# EAGLE design oresat-plusz-end-card (EAGLE 9.3.0)

## Sheet 1 of 3: Connectors
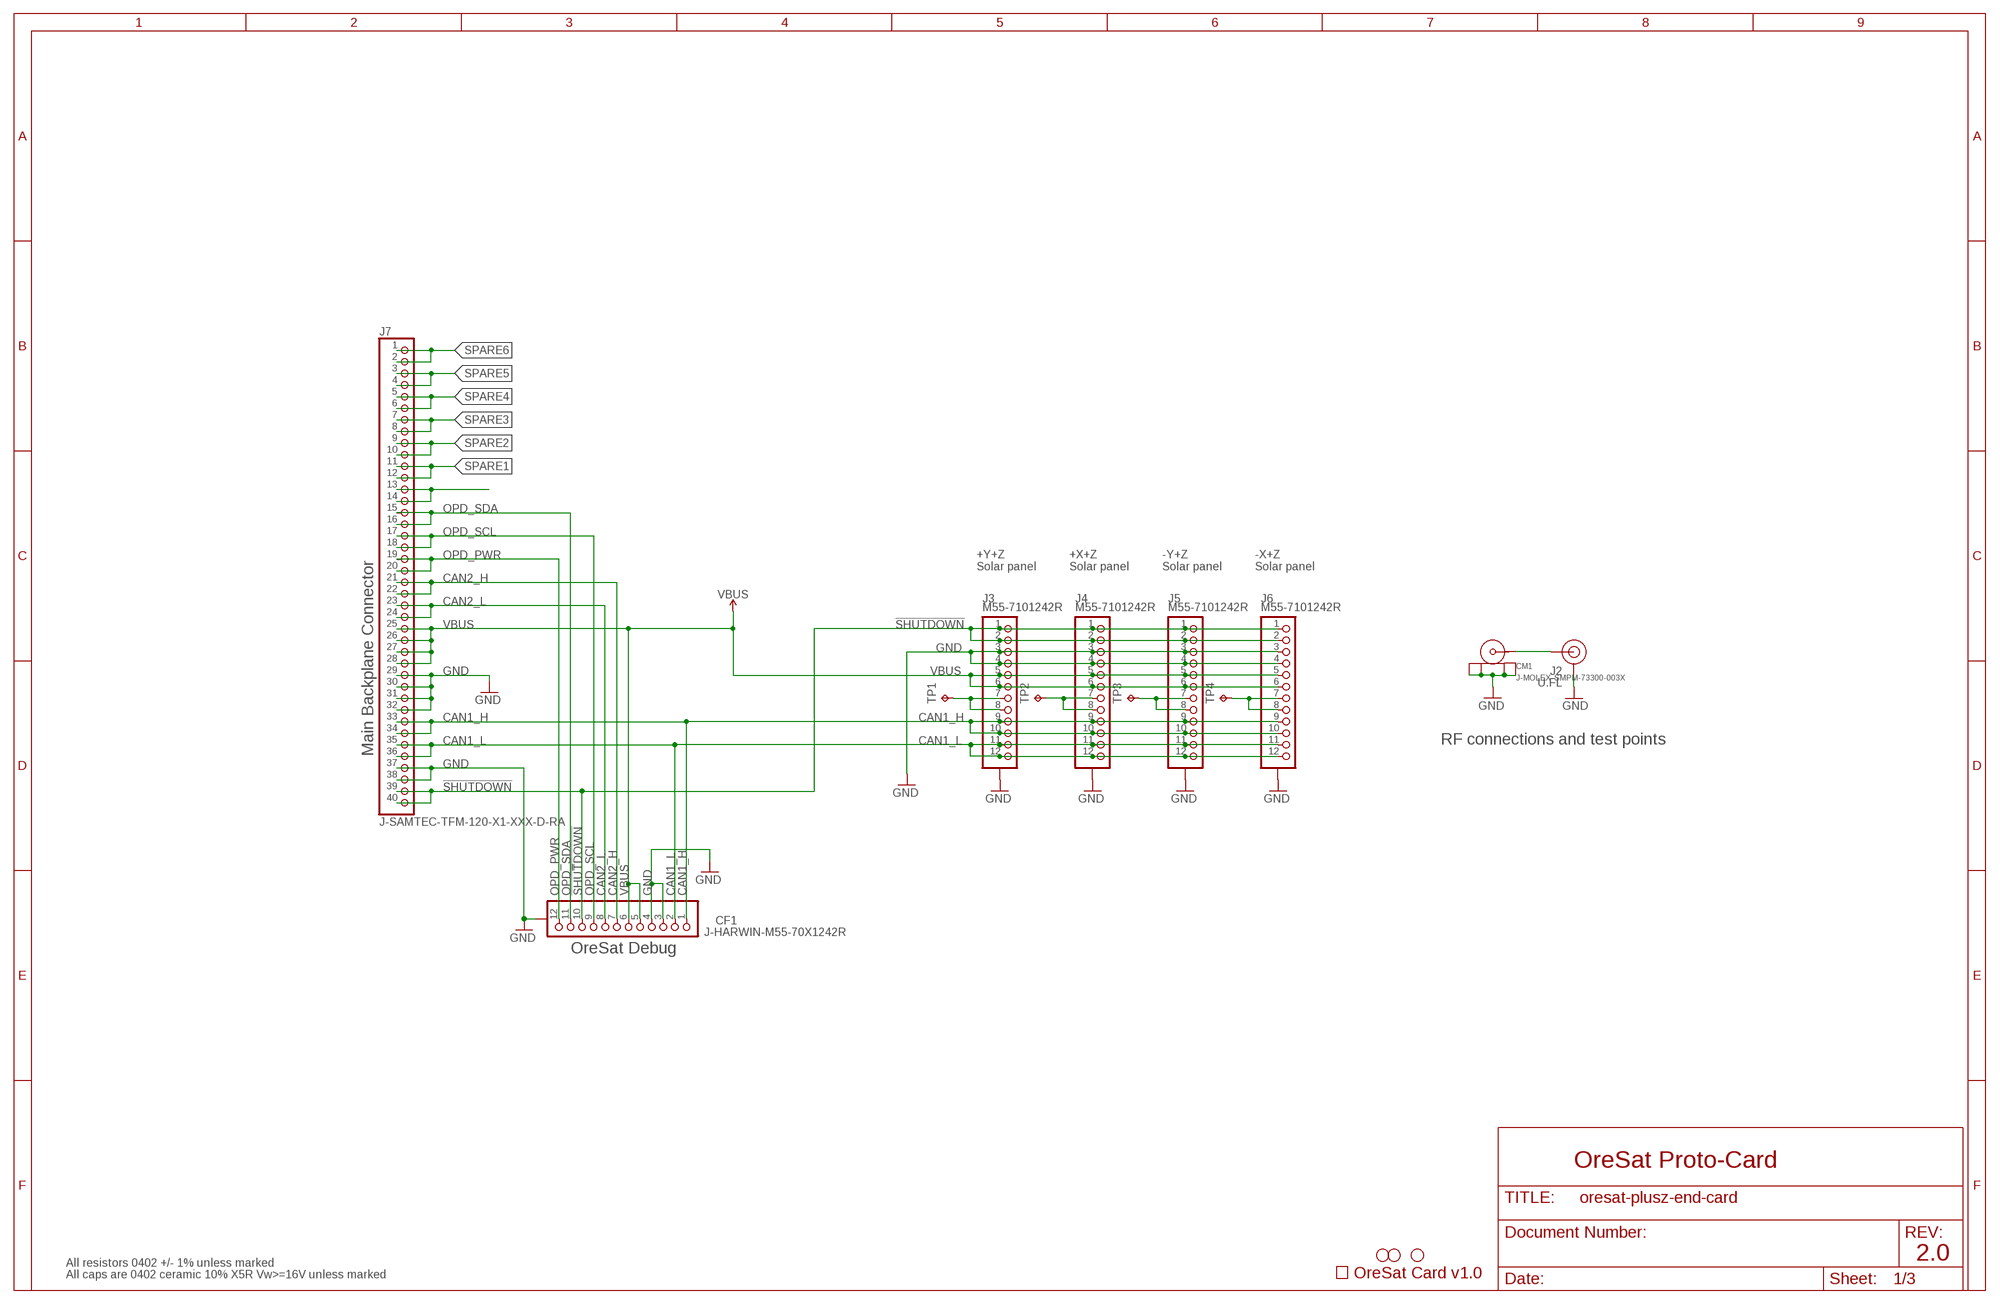
[diagram p0: schematic, sheet 1]

### Parts
CARD  ORESAT-CARD-V0.5  [ORESAT-CARD-V1.0]
CF1  J-HARWIN-M55-70X1242R  [HARWIN-M55-70X1242R]
CM1  J-MOLEX-SMPM-73300-003X  [J-MOLEX-SMPM-073300-003X]
H1  STAND-OFFTIGHT  [STAND-OFF-TIGHT]
H2  STAND-OFFTIGHT  [STAND-OFF-TIGHT]
H4  STAND-OFFTIGHT  [STAND-OFF-TIGHT]
J2  U.FL  U.FL2PIN  [U.FL]
J3  M55-7101242R  [M55-7101242R]
J4  M55-7101242R  [M55-7101242R]
J5  M55-7101242R  [M55-7101242R]
J6  M55-7101242R  [M55-7101242R]
J7  J-SAMTEC-TFM-120-X1-XXX-D-RA  [J-SAMTEC-TFM-120-X1-XXX-D-RA]
TP1  TPPAD1-13  [P1-13]
TP2  TPPAD1-13  [P1-13]
TP3  TPPAD1-13  [P1-13]
TP4  TPPAD1-13  [P1-13]

### Nets
!SHUTDOWN: CF1.10 J3.1 J3.2 J4.1 J4.2 J5.1 J5.2 J6.1 J6.2 J7.39 J7.40
CAN1_H: CF1.1 J3.9 J3.10 J4.9 J4.10 J5.9 J5.10 J6.9 J6.10 J7.33 J7.34 ; also sheet 3
CAN1_L: CF1.2 J3.11 J3.12 J4.11 J4.12 J5.11 J5.12 J6.11 J6.12 J7.35 J7.36 ; also sheet 3
CAN2_H: CF1.7 J7.21 J7.22
CAN2_L: CF1.8 J7.23 J7.24
GND: CF1.3 CF1.4 CF1.P$1(SHIELDS) CF1.P$2(SHIELDS) CF1.P$3(SHIELDS) CF1.P$4(SHIELDS) CM1.P$1(SHIELD3) CM1.P$2(SHIELD2) CM1.P$3(SHIELD1) CM1.P$4(SHIELD) J2.1(GND) J2.2(GND) J3.3 J3.4 J3.P$1(SHIELD) J3.P$2(SHIELD) J3.P$3(SHIELD) J3.P$4(SHIELD) J4.3 J4.4 J4.P$1(SHIELD) J4.P$2(SHIELD) J4.P$3(SHIELD) J4.P$4(SHIELD) J5.3 J5.4 J5.P$1(SHIELD) J5.P$2(SHIELD) J5.P$3(SHIELD) J5.P$4(SHIELD) J6.3 J6.4 J6.P$1(SHIELD) J6.P$2(SHIELD) J6.P$3(SHIELD) J6.P$4(SHIELD) J7.29 J7.30 J7.31 J7.32 J7.37 J7.38 ; also sheet 2,3
N$1: J4.7 J4.8 TP2.TP
N$2: J3.7 J3.8 TP1.TP
N$4: J5.7 J5.8 TP3.TP
N$5: J6.7 J6.8 TP4.TP
N$15: J7.13 J7.14
OPD_PWR: CF1.12 J7.19 J7.20 ; also sheet 2
OPD_SCL: CF1.9 J7.17 J7.18 ; also sheet 2
OPD_SDA: CF1.11 J7.15 J7.16 ; also sheet 2
RF1: CM1.RF(CENTER) J2.FEED(SIGNAL)
SPARE1: J7.11 J7.12
SPARE2: J7.9 J7.10
SPARE3: J7.7 J7.8
SPARE4: J7.5 J7.6
SPARE5: J7.3 J7.4
SPARE6: J7.1 J7.2
VBUS: CF1.5 CF1.6 J3.5 J3.6 J4.5 J4.6 J5.5 J5.6 J6.5 J6.6 J7.25 J7.26 J7.27 J7.28 ; also sheet 2

### Notes on the sheet
- +Y+Z
  Solar panel
- +X+Z
  Solar panel
- -Y+Z
  Solar panel
- -X+Z
  Solar panel
- RF connections and test points
- Main Backplane Connector
- OreSat Debug
- OreSat Proto-Card
- 2.0
- All resistors 0402 +/- 1% unless marked
- All caps are 0402 ceramic 10% X5R Vw>=16V unless marked

## Sheet 2 of 3: Power
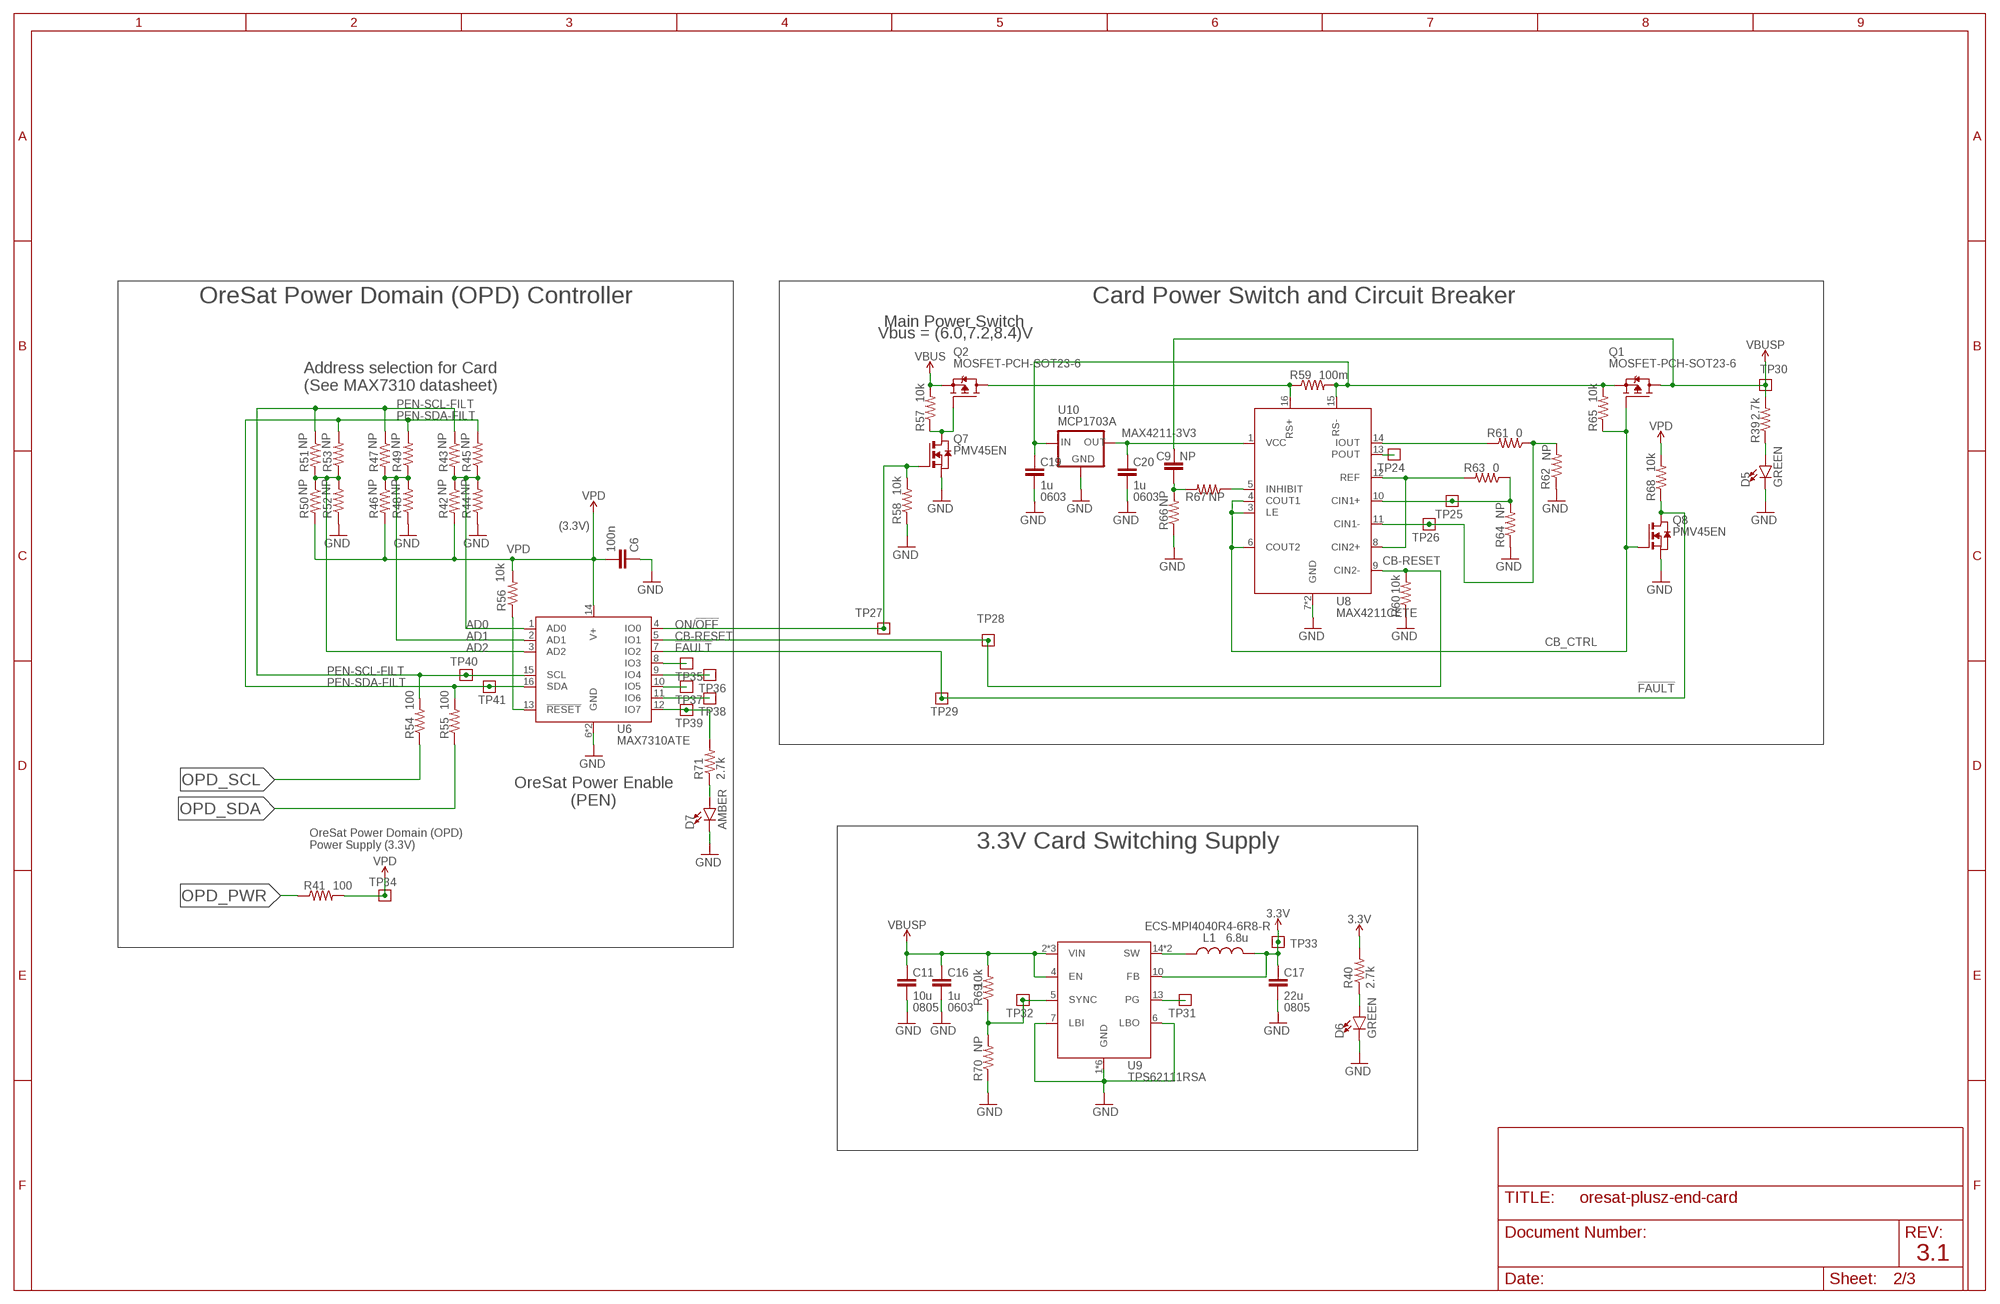
[diagram p1: schematic, sheet 2]

### Parts
C6  100n  C-EU0402-B-NOSILK  [.0402-B-NOSILK]
C9  NP  C-EU0402-B-NOSILK  [.0402-B-NOSILK]
C11  10u  C-EU0805-B-NOSILK  [.0805-B-NOSILK]
C16  1u  C-EU0603-B-NOSILK  [.0603-B-NOSILK]
C17  22u  C-EU0805-B-NOSILK  [.0805-B-NOSILK]
C19  1u  C-EU0603-B-NOSILK  [.0603-B-NOSILK]
C20  1u  C-EU0603-B-NOSILK  [.0603-B-NOSILK]
D5  GREEN  LED-GREEN0603  [LED-0603]
D6  GREEN  LED-GREEN0603  [LED-0603]
D7  AMBER  LED-GREEN0603  [LED-0603]
L1  6.8u  L-ECS-MPI4040  [ECS-MPI4040]
Q1  MOSFET-PCH-SOT23-6  [SOT23-6]
Q2  MOSFET-PCH-SOT23-6  [SOT23-6]
Q7  PMV45EN  [SOT23]
Q8  PMV45EN  [SOT23]
R39  2.7k  R-US_0402-B-NOSILK  [.0402-B-NOSILK]
R40  2.7k  R-US_0402-B-NOSILK  [.0402-B-NOSILK]
R41  100  R-US_0402-B-NOSILK  [.0402-B-NOSILK]
R42  NP  R-US_0402-B-NOSILK  [.0402-B-NOSILK]
R43  NP  R-US_0402-B-NOSILK  [.0402-B-NOSILK]
R44  NP  R-US_0402-B-NOSILK  [.0402-B-NOSILK]
R45  NP  R-US_0402-B-NOSILK  [.0402-B-NOSILK]
R46  NP  R-US_0402-B-NOSILK  [.0402-B-NOSILK]
R47  NP  R-US_0402-B-NOSILK  [.0402-B-NOSILK]
R48  NP  R-US_0402-B-NOSILK  [.0402-B-NOSILK]
R49  NP  R-US_0402-B-NOSILK  [.0402-B-NOSILK]
R50  NP  R-US_0402-B-NOSILK  [.0402-B-NOSILK]
R51  NP  R-US_0402-B-NOSILK  [.0402-B-NOSILK]
R52  NP  R-US_0402-B-NOSILK  [.0402-B-NOSILK]
R53  NP  R-US_0402-B-NOSILK  [.0402-B-NOSILK]
R54  100  R-US_0402-B-NOSILK  [.0402-B-NOSILK]
R55  100  R-US_0402-B-NOSILK  [.0402-B-NOSILK]
R56  10k  R-US_0402-B-NOSILK  [.0402-B-NOSILK]
R57  10k  R-US_0402-B-NOSILK  [.0402-B-NOSILK]
R58  10k  R-US_0402-B-NOSILK  [.0402-B-NOSILK]
R59  100m  R-US_R1206  [R1206]
R60  10k  R-US_0402-B-NOSILK  [.0402-B-NOSILK]
R61  0  R-US_0402-B-NOSILK  [.0402-B-NOSILK]
R62  NP  R-US_0402-B-NOSILK  [.0402-B-NOSILK]
R63  0  R-US_0402-B-NOSILK  [.0402-B-NOSILK]
R64  NP  R-US_0402-B-NOSILK  [.0402-B-NOSILK]
R65  10k  R-US_0402-B-NOSILK  [.0402-B-NOSILK]
R66  NP  R-US_0402-B-NOSILK  [.0402-B-NOSILK]
R67  NP  R-US_0402-B-NOSILK  [.0402-B-NOSILK]
R68  10k  R-US_0402-B-NOSILK  [.0402-B-NOSILK]
R69  10k  R-US_0402-B-NOSILK  [.0402-B-NOSILK]
R70  NP  R-US_0402-B-NOSILK  [.0402-B-NOSILK]
R71  2.7k  R-US_0402-B-NOSILK  [.0402-B-NOSILK]
TP24  TEST-POINT  [2MM-TEST-POINT]
TP25  TEST-POINT  [2MM-TEST-POINT]
TP26  TEST-POINT  [2MM-TEST-POINT]
TP27  TEST-POINT  [2MM-TEST-POINT]
TP28  TEST-POINT  [2MM-TEST-POINT]
TP29  TEST-POINT  [2MM-TEST-POINT]
TP30  TEST-POINT  [2MM-TEST-POINT]
TP31  TEST-POINT  [2MM-TEST-POINT]
TP32  TEST-POINT  [2MM-TEST-POINT]
TP33  TEST-POINT  [2MM-TEST-POINT]
TP34  TEST-POINT  [2MM-TEST-POINT]
TP35  TEST-POINT  [2MM-TEST-POINT]
TP36  TEST-POINT  [2MM-TEST-POINT]
TP37  TEST-POINT  [2MM-TEST-POINT]
TP38  TEST-POINT  [2MM-TEST-POINT]
TP39  TEST-POINT  [2MM-TEST-POINT]
TP40  TEST-POINT  [2MM-TEST-POINT]
TP41  TEST-POINT  [2MM-TEST-POINT]
U6  MAX7310ATE  MAX7310  [QFN65P400X400X80-17T210]
U8  MAX4211CETE  MAX4211  [QFN65P400X400X80-17T210]
U9  TPS62111RSA  TPS6211X  [S-PVQFN-16]
U10  MCP1703A  XC63FPM  [SOT23]

### Nets
3.3V: C17.1 L1.2 R40.2 TP33.1 U9.10(FB) ; also sheet 3
!FAULT: Q8.3(D) R68.1 TP29.1 U6.7(IO2)
AD0: R42.1 R43.2 R44.2 R45.1 U6.1(AD0)
AD1: R46.1 R47.2 R48.2 R49.1 U6.2(AD1)
AD2: R50.1 R51.2 R52.2 R53.1 U6.3(AD2)
CB-RESET: R60.2 TP28.1 U6.5(IO1) U8.9(CIN2-)
CB_CTRL: Q1.3(G) Q8.1(G) R65.1 U8.3(LE) U8.4(COUT1) U8.6(COUT2)
GND: C6.1 C11.2 C16.2 C17.2 C19.2 C20.2 D5.C D6.C D7.C Q7.2(S) Q8.2(S) R44.1 R48.1 R52.1 R58.1 R60.1 R62.1 R64.1 R66.1 R70.1 U6.6(GND) U6.EPAD(GND) U8.7(GND) U8.EPAD(GND) U9.1(GND) U9.6(LBO) U9.7(LBI) U9.9(GND) U9.11(GND) U9.12(GND) U9.16(GND) U9.PAD(GND) U10.1(GND) ; also sheet 1,3
MAX4211-3V3: C20.1 U8.1(VCC) U10.2(OUT)
N$6: D5.A R39.1
N$8: D6.A R40.1
N$9: R56.1 U6.13(!RESET)
N$10: Q2.3(G) Q7.3(D) R57.1
N$11: Q2.1(D) Q2.2(D) Q2.5(D) Q2.6(D) R59.1 U8.16(RS+)
N$12: R61.1 R62.2 TP26.1 U8.11(CIN1-)
N$13: R63.1 R64.2 TP25.1 U8.10(CIN1+)
N$14: R61.2 U8.14(IOUT)
N$16: R63.2 U8.8(CIN2+) U8.12(REF)
N$17: TP24.1 U8.13(POUT)
N$18: R67.1 U8.5(INHIBIT)
N$19: C9.1 R66.2 R67.2
N$20: C19.1 Q1.4(S) R59.2 R65.2 U8.15(RS-) U10.3(IN)
N$21: TP35.1 U6.8(IO3)
N$22: TP36.1 U6.9(IO4)
N$23: TP37.1 U6.10(IO5)
N$24: TP38.1 U6.11(IO6)
N$25: R71.2 TP39.1 U6.12(IO7)
N$26: D7.A R71.1
ON/!OFF: Q7.1(G) R58.2 TP27.1 U6.4(IO0)
OPD_PWR: R41.1 ; also sheet 1
OPD_SCL: R54.1 ; also sheet 1
OPD_SDA: R55.1 ; also sheet 1
PEN-SCL-FILT: R43.1 R47.1 R51.1 R54.2 TP40.1 U6.15(SCL)
PEN-SDA-FILT: R45.2 R49.2 R53.2 R55.2 TP41.1 U6.16(SDA)
TPS62111-PG1: TP31.1 U9.13(PG)
TPS62111-SYNC1: R69.1 R70.2 TP32.1 U9.5(SYNC)
TPS62111_SW1: L1.1 U9.14(SW) U9.15(SW)
VBUS: Q2.4(S) R57.2 ; also sheet 1
VBUSP: C9.2 C11.1 C16.1 Q1.1(D) Q1.2(D) Q1.5(D) Q1.6(D) R39.2 R69.2 TP30.1 U9.2(VIN) U9.3(VIN) U9.4(EN) U9.8(VIN)
VPD: C6.2 R41.2 R42.2 R46.2 R50.2 R56.2 R68.2 TP34.1 U6.14(V+)

### Notes on the sheet
- OreSat Power Domain (OPD) Controller | Card Power Switch and Circuit Breaker
- Main Power Switch
- Vbus = (6.0,7.2,8.4)V
- Address selection for Card
  (See MAX7310 datasheet)
- 0603 | 0603
- (3.3V)
- OreSat Power Enable
  (PEN)
- OreSat Power Domain (OPD)
  Power Supply (3.3V)
- 3.3V Card Switching Supply
- ECS-MPI4040R4-6R8-R
- 0805 | 0603 | 0805
- 3.1

## Sheet 3 of 3: Microcontroller
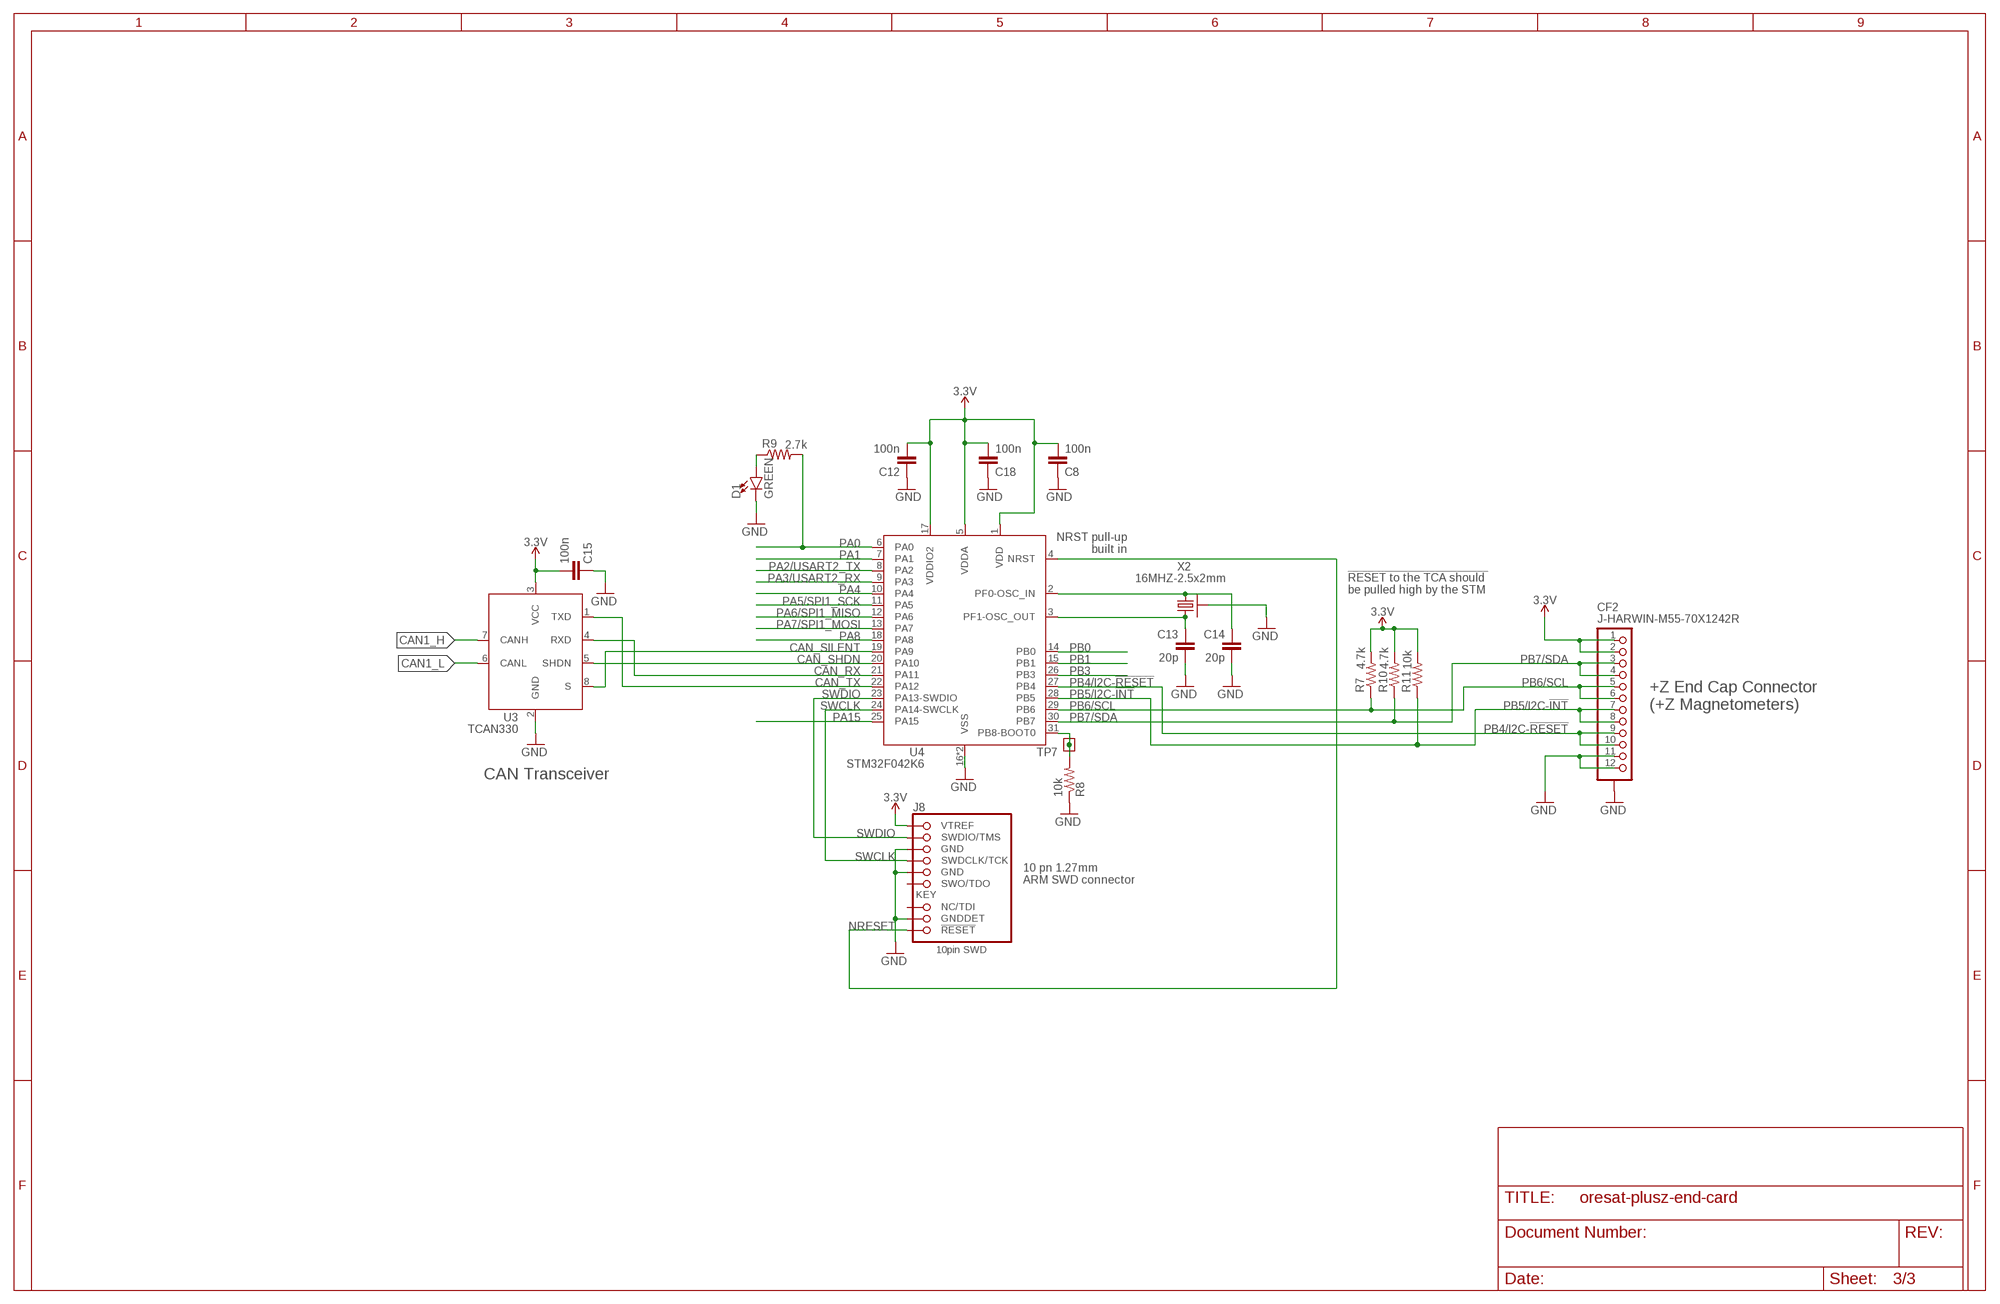
[diagram p2: schematic, sheet 3]

### Parts
C8  100n  C-EU0402-B-NOSILK  [.0402-B-NOSILK]
C12  100n  C-EU0402-B-NOSILK  [.0402-B-NOSILK]
C13  20p  C-EU0402-B-NOSILK  [.0402-B-NOSILK]
C14  20p  C-EU0402-B-NOSILK  [.0402-B-NOSILK]
C15  100n  C-EU0402-B-NOSILK  [.0402-B-NOSILK]
C18  100n  C-EU0402-B-NOSILK  [.0402-B-NOSILK]
CF2  J-HARWIN-M55-70X1242R  [HARWIN-M55-70X1242R]
D1  GREEN  LED-GREEN0603  [LED-0603]
J8  FTSH-105-XX-X-DV-K  [CON10_2X5_DUK_FTSH]
R7  4.7k  R-US_0402-B-NOSILK  [.0402-B-NOSILK]
R8  10k  R-US_0402-B-NOSILK  [.0402-B-NOSILK]
R9  2.7k  R-US_0402-B-NOSILK  [.0402-B-NOSILK]
R10  4.7k  R-US_0402-B-NOSILK  [.0402-B-NOSILK]
R11  10k  R-US_0402-B-NOSILK  [.0402-B-NOSILK]
TP7  TEST-POINT  [2MM-TEST-POINT]
U3  TCAN330  [SOT23-8_TI-DCN]
U4  STM32F042K6  [QFP32-7X7]
X2  16MHZ-2.5x2mm  CRYSTAL-WITH-GND  [CRYSTAL_2.5X2]

### Nets
3.3V: C8.2 C12.2 C15.2 C18.2 CF2.1 CF2.2 J8.1(VTREF) R7.2 R10.2 R11.2 U3.3(VCC) U4.1(VDD) U4.5(VDDA) U4.17(VDDIO2) ; also sheet 2
BOOT1: R8.2 TP7.1 U4.31(PB8-BOOT0)
CAN1_H: U3.7(CANH) ; also sheet 1
CAN1_L: U3.6(CANL) ; also sheet 1
CAN_RX: U3.4(RXD) U4.21(PA11)
CAN_SHDN: U3.5(SHDN) U4.20(PA10)
CAN_SILENT: U3.8(S) U4.19(PA9)
CAN_TX: U3.1(TXD) U4.22(PA12)
CRYSTALIN1: C14.1 U4.2(PF0-OSC_IN) X2.1
CRYSTALOUT1: C13.1 U4.3(PF1-OSC_OUT) X2.3
GND: C8.1 C12.1 C13.2 C14.2 C15.1 C18.1 CF2.11 CF2.12 CF2.P$1(SHIELDS) CF2.P$2(SHIELDS) CF2.P$3(SHIELDS) CF2.P$4(SHIELDS) D1.C J8.3(GND) J8.5(GND) J8.9(GNDDET) R8.1 U3.2(GND) U4.16(VSS) U4.32(VSS) X2.2(SHIELD) X2.4(SHIELD) ; also sheet 1,2
N$7: D1.A R9.1
NRESET: J8.10(!RESET) U4.4(NRST)
PA0: R9.2 U4.6(PA0)
PA1: U4.7(PA1)
PA2/USART2_TX: U4.8(PA2)
PA3/USART2_RX: U4.9(PA3)
PA4: U4.10(PA4)
PA5/SPI1_SCK: U4.11(PA5)
PA6/SPI1_MISO: U4.12(PA6)
PA7/SPI1_MOSI: U4.13(PA7)
PA8: U4.18(PA8)
PA15: U4.25(PA15)
PB0: U4.14(PB0)
PB1: U4.15(PB1)
PB3: U4.26(PB3)
PB4/I2C-!RESET: CF2.9 CF2.10 U4.27(PB4)
PB5/I2C-!INT: CF2.7 CF2.8 R11.1 U4.28(PB5)
PB6/SCL: CF2.5 CF2.6 R7.1 U4.29(PB6)
PB7/SDA: CF2.3 CF2.4 R10.1 U4.30(PB7)
SWCLK: J8.4(SWDCLK/TCK) U4.24(PA14-SWCLK)
SWDIO: J8.2(SWDIO/TMS) U4.23(PA13-SWDIO)
Unconnected: J8.6(SWO/TDO) J8.8(NC/TDI)

### Notes on the sheet
- NRST pull-up
  built in
- !RESET to the TCA should 
  be pulled high by the STM
- +Z End Cap Connector
  (+Z Magnetometers)
- CAN Transceiver
- 10 pn 1.27mm 
  ARM SWD connector

## Library data of the parts
C6 C8 C9 C12 C15 C18 = rcl_custom:C-EU: CAPACITOR, European symbol; DIS: Digi-Key; DPN: 1276-1001-1-ND; MFR: Samsung; MPN: CL05B104KO5NNNC
C11 C17 = oresat-rcl:C-EU: CAPACITOR, European symbol
C13 C14 = rcl_custom:C-EU: CAPACITOR, European symbol; DIS: Digi-Key; DPN: 1276-6601-1-ND; MFR: Samsung; MPN: CL05C200JB51PNC
C16 C19 C20 = oresat-rcl:C-EU: CAPACITOR, European symbol; DIS: Digi-Key; DPN: 1276-1001-1-ND; MFR: Samsung; MPN: CL05B104KO5NNNC
CARD = oresat-card:ORESAT-CARD-V0.5
CF1 CF2 = J-Harwin-M55-70X1242R-12pin-1.27mm-M-vertical:J-HARWIN-M55-70X1242R
CM1 = J-Molex-SMPM-73300-003X:J-MOLEX-SMPM-73300-003X
D1 = SparkFun-LED:LED-GREEN: Green SMD LED Used in manufacturing of various products at SparkFun Packages: 0603 - SMD 0603 package [Product Link] <http://www.futureelectronics.com/en/technologies/semiconductors/optoelectronics/leds/Pages/9894312-LTST-C190GKT.aspx?CrossPart=HSMG-C190&IM=0> LilyPad 1206 - SMD1206 LilyPad package [Product Link] <http://www.futureelectronics.com/en/Technologies/Product.aspx?ProductID=IN150NGHARVATEKCORPORATION2049943&IM=0> 1206 - SMD1206 package [Product Link] <http://www.futureelectronics.com/en/technologies/semiconductors/optoelectronics/leds/Pages/8315665-LTST-C150KGKT.aspx?IM=0> 1206 Bottom Mount -SMD 1206 Bottom Mount [Product Link] <http://www.digikey.com/product-detail/en/lite-on-inc/LTST-C230KGKT/160-1456-1-ND/386854> SparkFun Products: Pro Mini 328 -5V <https://www.sparkfun.com/products/821> RedBoard <https://www.sparkfun.com/products/12757> MP3 Trigger <https://www.sparkfun.com/products/13720> Makey Makey <https://www.sparkfun.com/products/11076>; PROD_ID: DIO-00821
D5 D6 = SparkFun-LED:LED-GREEN: Green SMD LED Used in manufacturing of various products at SparkFun Packages: 0603 - SMD 0603 package [Product Link] <http://www.futureelectronics.com/en/technologies/semiconductors/optoelectronics/leds/Pages/9894312-LTST-C190GKT.aspx?CrossPart=HSMG-C190&IM=0> LilyPad 1206 - SMD1206 LilyPad package [Product Link] <http://www.futureelectronics.com/en/Technologies/Product.aspx?ProductID=IN150NGHARVATEKCORPORATION2049943&IM=0> 1206 - SMD1206 package [Product Link] <http://www.futureelectronics.com/en/technologies/semiconductors/optoelectronics/leds/Pages/8315665-LTST-C150KGKT.aspx?IM=0> 1206 Bottom Mount -SMD 1206 Bottom Mount [Product Link] <http://www.digikey.com/product-detail/en/lite-on-inc/LTST-C230KGKT/160-1456-1-ND/386854> SparkFun Products: Pro Mini 328 -5V <https://www.sparkfun.com/products/821> RedBoard <https://www.sparkfun.com/products/12757> MP3 Trigger <https://www.sparkfun.com/products/13720> Makey Makey <https://www.sparkfun.com/products/11076>
D7 = SparkFun-LED:LED-GREEN: Green SMD LED Used in manufacturing of various products at SparkFun Packages: 0603 - SMD 0603 package [Product Link] <http://www.futureelectronics.com/en/technologies/semiconductors/optoelectronics/leds/Pages/9894312-LTST-C190GKT.aspx?CrossPart=HSMG-C190&IM=0> LilyPad 1206 - SMD1206 LilyPad package [Product Link] <http://www.futureelectronics.com/en/Technologies/Product.aspx?ProductID=IN150NGHARVATEKCORPORATION2049943&IM=0> 1206 - SMD1206 package [Product Link] <http://www.futureelectronics.com/en/technologies/semiconductors/optoelectronics/leds/Pages/8315665-LTST-C150KGKT.aspx?IM=0> 1206 Bottom Mount -SMD 1206 Bottom Mount [Product Link] <http://www.digikey.com/product-detail/en/lite-on-inc/LTST-C230KGKT/160-1456-1-ND/386854> SparkFun Products: Pro Mini 328 -5V <https://www.sparkfun.com/products/821> RedBoard <https://www.sparkfun.com/products/12757> MP3 Trigger <https://www.sparkfun.com/products/13720> Makey Makey <https://www.sparkfun.com/products/11076>; VALUE: GREEN
H1 H2 H4 = SparkFun-Hardware:STAND-OFF: Stand Off Drill holes for mechanically mounting via screws, standoffs, etc. Note: Use the keepout ring to avoid running the screw head into surrounding components. Variant Overviews STAND-OFF - Mechanical footprint for a #4 phillips button head screw. STAND-OFF-TIGHT - Mechanical footprint for a #4 phillips button head screw, Example SparkFun Products Screw - Phillips Head (1/4", 4-40, 10 pack) <https://www.sparkfun.com/products/10453> (PRT-10453) Screw - Phillips Head (1/2", 4-40, 10 pack) <https://www.sparkfun.com/products/10452> (PRT-10452) Screw - Phillips Head (3/4", 4-40, 10 pack) <https://www.sparkfun.com/products/10451> (PRT-10451) Screw - Phillips Head (1", 4-40, 10 pack) <https://www.sparkfun.com/products/10450> (PRT-10450)
J2 = SparkFun-Connectors:U.FL2PIN: SMD Antenna Connector - U.FL 2mm height, 3.0mm x 3.0mm receptacle size. SparkFun Products: SparkFun WiFi Shield - ESP8266 <https://www.sparkfun.com/products/13287> SparkFun ESP8266 Thing <https://www.sparkfun.com/products/13231> SparkFun MiniGen - Pro Mini Signal Generator Shield <https://www.sparkfun.com/products/11420>; PROD_ID: CONN-09193; SF_ID: WRL-09144
J3-J6 = J-Harwin-M55-7101242:M55-7101242R: Harwin M55-7101242R A 12 pin 1.27 mm male SMT connector with plastic alignment pins. Note: alignment pin hole diameters are 0.05 mm smaller than recommended in order to tighten up connector location; this requires hand placement of this package.
J7 = J-Samtec-TFM-120-X1-XXX-D-RA:J-SAMTEC-TFM-120-X1-XXX-D-RA
J8 = J-Samtec-FTSH-105-XXX-DV-K-ARM-SWD:FTSH-105-XX-X-DV-K; DIS: Digi-Key; DPN: 1175-1627-ND; MFR: CNC Tech; MPN: 3220-10-0100-00
L1 = L-ECS-MPI4040:L-ECS-MPI4040; MFR: ECS; MPN: ECS-MPI4040R4-6R8-R
Q1 Q2 = Q-MOSFET-PCH-SOT23-6:MOSFET-PCH-SOT23-6: P channel MOSFET in an SOT23-6; MFR: Diodes Inc; MPN: DMP3050LVT-7
Q7 Q8 = Tova:PMV45EN
R7-R11 R39-R58 R60-R71 = rcl_custom:R-US_: RESISTOR, American symbol; DIS: Digi-Key; DPN: 1276-4275-1-ND; MFR: Samsung; MPN: RC1005F6653CS
R59 = rcl:R-US_: RESISTOR, American symbol; SPICEPREFIX: R
TP1-TP4 = testpad:TP: Test pad
TP7 TP24-TP41 = Tova:TEST-POINT
U3 = TCAN330:TCAN330; DIS: Digi-Key; DPN: 296-44211-1-ND; MFR: Texas Instruments; MPN: TCAN330GDCNT
U4 = STM32F042K:STM32F042K6; DIS: Digi-Key; DPN: STM32F042K6T7-ND; MFR: STMicroelectronics; MPN: STM32F042K6T7
U6 = U-Maxim-MAX7310-I2C-GPIO-expander:MAX7310; MFR: Maxim; MPN: MAX7310ATE
U8 = U-Maxim-MAX4211-power-monitor:MAX4211; MFR: Maxim; MPN: MAX4211CETE
U9 = U-TI-TPS6211x-SPS-buck:TPS6211X: TPS6211x 17-V, 1.5-A, Synchronous Step-Down Converter; MFR: TI; MPN: TPS62111RSA
U10 = v-reg:XC63FP: Positiv Voltage Regulators www.torex.co.jp/english/product/pro02/pdf/0201_xc62fp.pdf; MFR: Microchip; MPN: MCP1703AT-3302E/CB
X2 = low-gain-radio:CRYSTAL-WITH-GND; DIS: Digi-Key; DPN: XC2181CT-ND; MFR: ECS Inc.; MPN: ECS-160-10-36Q-ES-TR

## Board
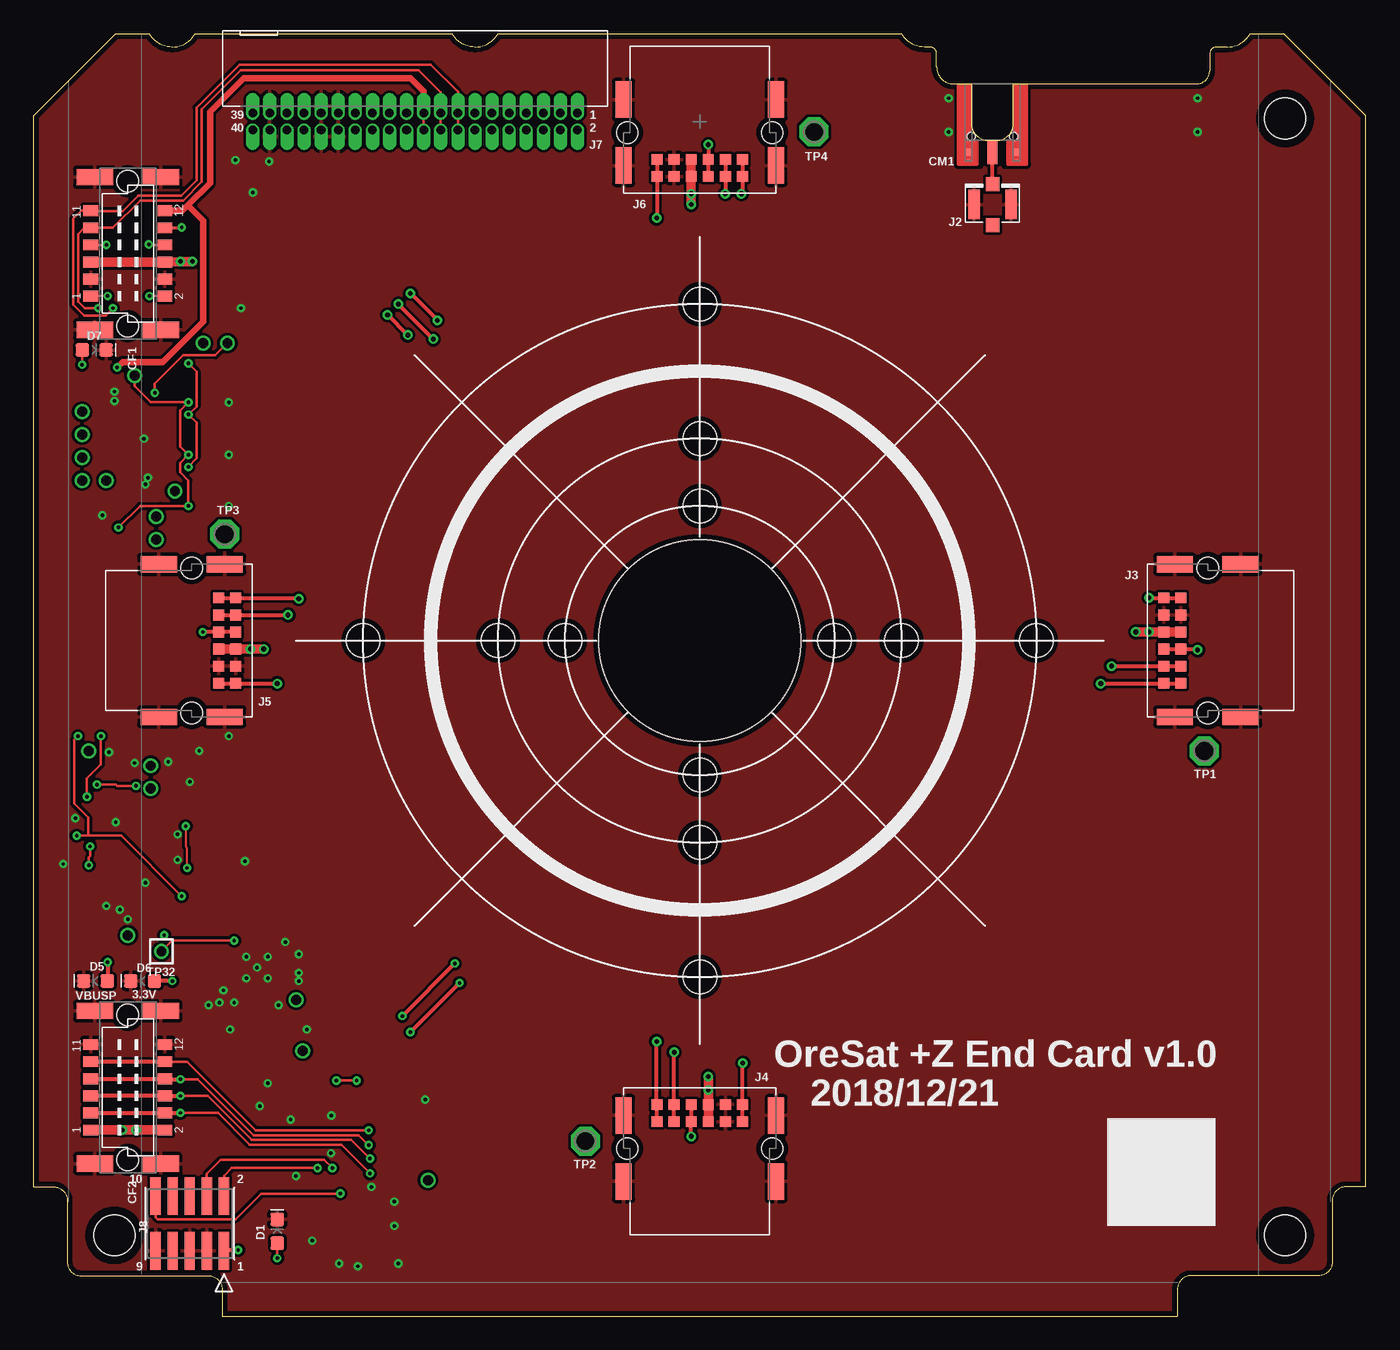
[diagram p3: board, top side]
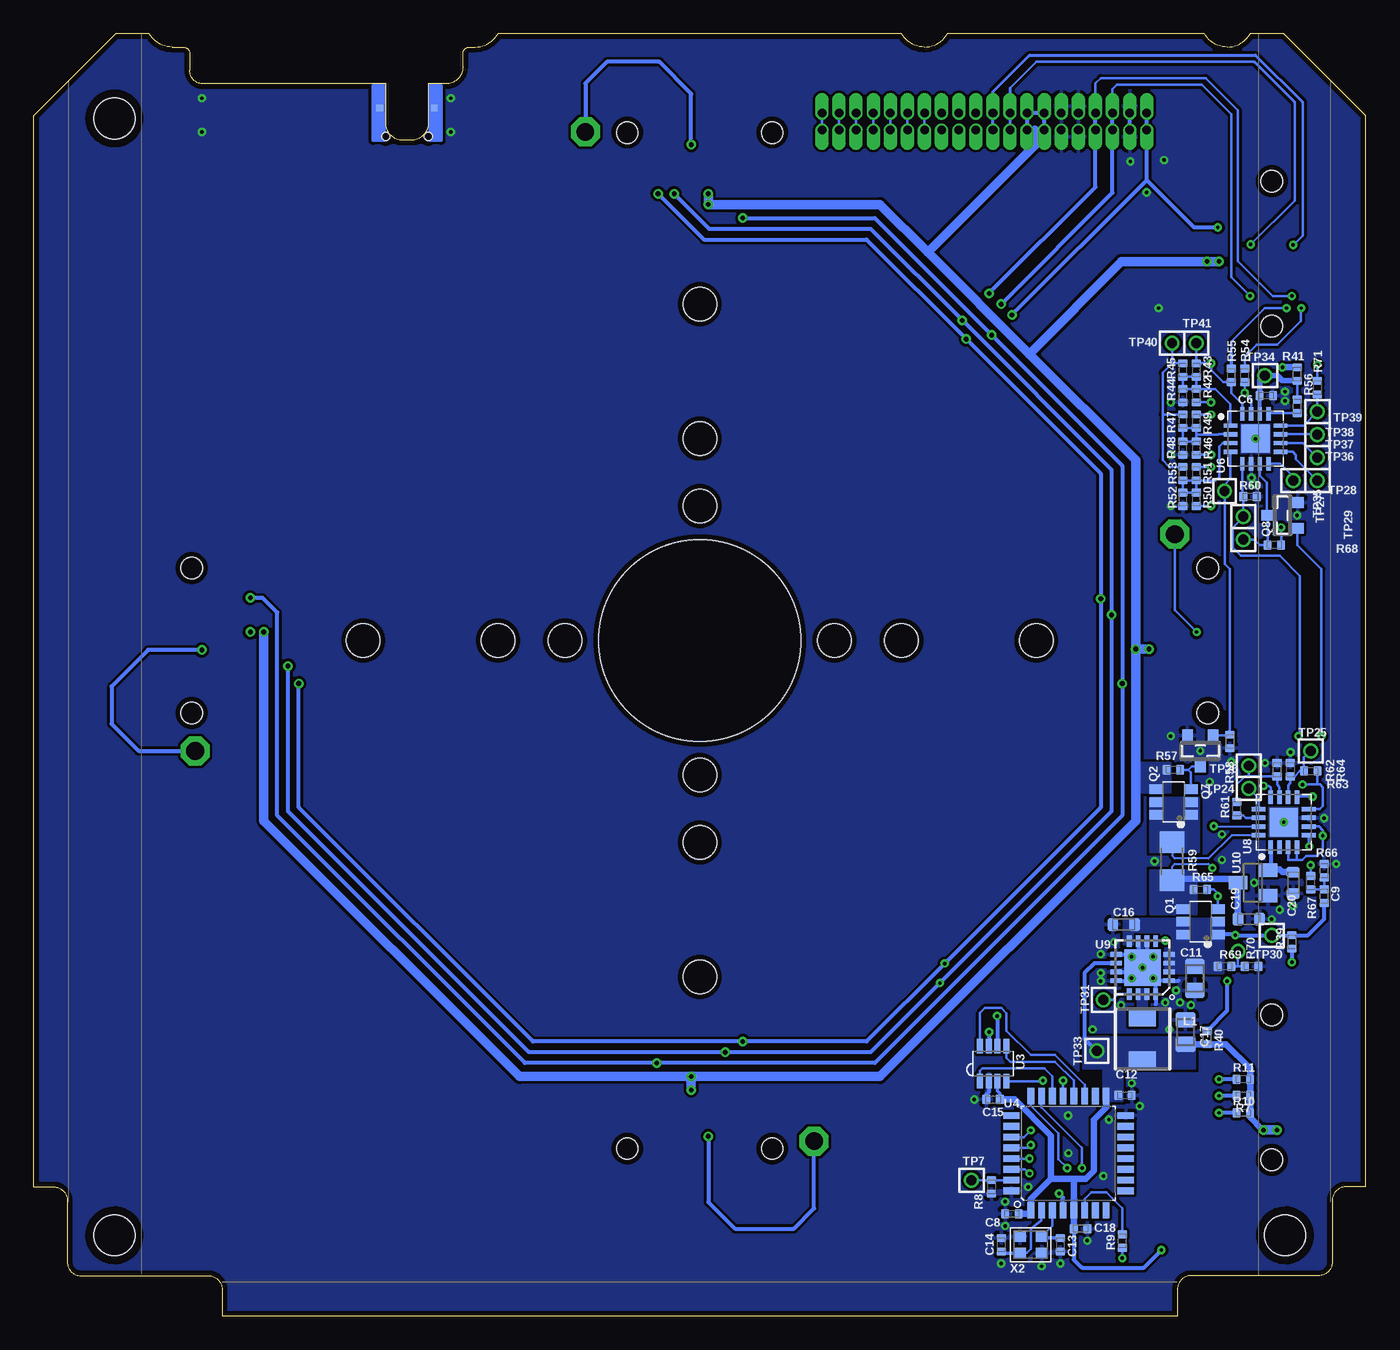
[diagram p4: board, bottom side, seen from below]

Size 99 x 95.3 mm. Coordinates in mm from the lower left corner, seen from the top.
Outline: 66.2,94.3 66.61,94.3 arc-90 67.11,93.8 67.11,92.83 arc90 68.38,91.56 69.25,91.56
Outline: 88.7,94.3 87.89,94.3 arc90 87.39,93.8 87.39,92.56 arc-90 86.4,91.56 73.25,91.56
Copper layers (1*16): Top 0.0356mm / dielectric 1.5011mm / Bottom 0.0356mm
Design rules "OSH-Park-2-layer *": minimum track width 6mil, minimum drill 10mil, track to track 6mil, track to pad 6mil, pad to pad 6mil, via to via 6mil, smd to smd 6mil, copper to edge 15mil, drill to drill 6mil, minimum pad ring 7mil, minimum via ring 7mil, stop-mask expansion 3mil, vias tented up to drill 13mil, thermal gap 10mil
Holes 15 mm at 49.5,50.2
Holes 2.5 mm at 49.5,60.2 59.5,50.2 49.5,40.2 39.5,50.2 74.5,50.2 49.5,25.2 49.5,75.2 24.5,50.2 34.5,50.2 49.5,65.2 64.5,50.2 49.5,35.2

### Footprints (pad centres in the part's own frame; a part is rotated, then mirrored left to right if it is on the bottom)
.0402-B-NOSILK = smd 0.6 x 0.7: 1 -0.5,0; 2 0.5,0
.0805-B-NOSILK = smd 1.15 x 1.45: 1 -0.9,0; 2 0.9,0
.0603-B-NOSILK = smd 0.8 x 0.95: 1 -0.8,0; 2 0.8,0
HARWIN-M55-70X1242R = smd 0.8 x 1.1: 1 3.175,-2.75; 2 3.175,2.75; 3 1.905,-2.75; 4 1.905,2.75; 5 0.635,-2.75; 6 0.635,2.75; 7 -0.635,-2.75; 8 -0.635,2.75; 9 -1.905,-2.75; 10 -1.905,2.75; 11 -3.175,-2.75; 12 -3.175,2.75 | smd 1.2 x 2.7: P$1 -5.67,-2.45; P$2 -5.67,2.45; P$3 5.67,2.45; P$4 5.67,-2.45 | hole 1.6: -5.385,0; 5.385,0
J-MOLEX-SMPM-073300-003X = smd 0.508 x 0.508: P$1 -1.778,-5.08; P$2 1.778,-5.08 | smd 0.508 x 0.508 bottom: P$3 -2.032,-1.778; P$4 2.032,-1.778 | smd 0.762 x 1.778: RF 0,-5.08 | hole 0.61: 1.587,-3.886; -1.587,-3.886
LED-0603 = smd 1 x 1: A -0.877,0; C 0.877,0
STAND-OFF-TIGHT = hole 3.048: 0,0
U.FL = smd 2.2 x 0.85: 1 0,1.375; 2 0,-1.375 | smd 1.05 x 1: FEED 1.525,0; NC -1.525,0
M55-7101242R = smd 0.8 x 0.8: 1 3.175,2; 2 3.175,3.27; 3 1.905,2; 4 1.905,3.27; 5 0.635,2; 6 0.635,3.27; 7 -0.635,2; 8 -0.635,3.27; 9 -1.905,2; 10 -1.905,3.27; 11 -3.175,2; 12 -3.175,3.27 | smd 1.2 x 2.7: P$1 5.67,2.45; P$2 5.67,-2.45; P$3 -5.67,2.45; P$4 -5.67,-2.45 | hole 1.6: 5.385,0; -5.385,0
J-SAMTEC-TFM-120-X1-XXX-D-RA = drill 0.635 pad 0.965 offset: 1 12.065,0.635; 2 12.065,-0.635; 3 10.795,0.635; 4 10.795,-0.635; 5 9.525,0.635; 6 9.525,-0.635; 7 8.255,0.635; 8 8.255,-0.635; 9 6.985,0.635; 10 6.985,-0.635; 11 5.715,0.635; 12 5.715,-0.635; 13 4.445,0.635; 14 4.445,-0.635; 15 3.175,0.635; 16 3.175,-0.635; 17 1.905,0.635; 18 1.905,-0.635; 19 0.635,0.635; 20 0.635,-0.635; 21 -0.635,0.635; 22 -0.635,-0.635; 23 -1.905,0.635; 24 -1.905,-0.635; 25 -3.175,0.635; 26 -3.175,-0.635; 27 -4.445,0.635; 28 -4.445,-0.635; 29 -5.715,0.635; 30 -5.715,-0.635; 31 -6.985,0.635; 32 -6.985,-0.635; 33 -8.255,0.635; 34 -8.255,-0.635; 35 -9.525,0.635; 36 -9.525,-0.635; 37 -10.795,0.635; 38 -10.795,-0.635; 39 -12.065,0.635; 40 -12.065,-0.635
CON10_2X5_DUK_FTSH = smd 0.762 x 2.794: 1 2.54,-2.032; 2 2.54,2.032; 3 1.27,-2.032; 4 1.27,2.032; 5 0,-2.032; 6 0,2.032; 7 -1.27,-2.032; 8 -1.27,2.032; 9 -2.54,-2.032; 10 -2.54,2.032
ECS-MPI4040 = smd 2 x 1.3: 1 0,1.575; 2 0,-1.575
SOT23-6 = smd 0.7 x 1: 1 -0.95,-1.3; 2 0,-1.3; 3 0.95,-1.3; 4 0.95,1.3; 5 0,1.3; 6 -0.95,1.3
SOT23 = smd 0.787 x 0.889: 1 -0.953,-1.143; 2 0.953,-1.143; 3 0,1.143
R1206 = smd 1.6 x 1.803: 1 -1.422,0; 2 1.422,0
P1-13 = drill 1.321 pad 2.159 octagon: TP 0,0
2MM-TEST-POINT = drill 0.737: 1 0,0
SOT23-8_TI-DCN = smd 0.45 x 1.1: 1 -0.975,-1.3; 2 -0.325,-1.3; 3 0.325,-1.3; 4 0.975,-1.3; 5 0.975,1.3; 6 0.325,1.3; 7 -0.325,1.3; 8 -0.975,1.3
QFP32-7X7 = smd 1.2 x 0.5: 1 -4.25,2.8; 2 -4.25,2; 3 -4.25,1.2; 4 -4.25,0.4; 5 -4.25,-0.4; 6 -4.25,-1.2; 7 -4.25,-2; 8 -4.25,-2.8; 17 4.25,-2.8; 18 4.25,-2; 19 4.25,-1.2; 20 4.25,-0.4; 21 4.25,0.4; 22 4.25,1.2; 23 4.25,2; 24 4.25,2.8 | smd 0.5 x 1.2: 9 -2.8,-4.25; 10 -2,-4.25; 11 -1.2,-4.25; 12 -0.4,-4.25; 13 0.4,-4.25; 14 1.2,-4.25; 15 2,-4.25; 16 2.8,-4.25; 25 2.8,4.25; 26 2,4.25; 27 1.2,4.25; 28 0.4,4.25; 29 -0.4,4.25; 30 -1.2,4.25; 31 -2,4.25; 32 -2.8,4.25
QFN65P400X400X80-17T210 = smd 1.01 x 0.32: 1 -1.86,0.975; 2 -1.86,0.325; 3 -1.86,-0.325; 4 -1.86,-0.975; 9 1.86,-0.975; 10 1.86,-0.325; 11 1.86,0.325; 12 1.86,0.975 | smd 0.32 x 1.01: 5 -0.975,-1.86; 6 -0.325,-1.86; 7 0.325,-1.86; 8 0.975,-1.86; 13 0.975,1.86; 14 0.325,1.86; 15 -0.325,1.86; 16 -0.975,1.86 | smd 2.1 x 2.1: EPAD 0,0
S-PVQFN-16 = smd 0.85 x 0.35: 1 -1.975,0.975; 2 -1.975,0.325; 3 -1.975,-0.325; 4 -1.975,-0.975; 9 1.975,-0.975; 10 1.975,-0.325; 11 1.975,0.325; 12 1.975,0.975 | smd 0.35 x 0.85: 5 -0.975,-1.975; 6 -0.325,-1.975; 7 0.325,-1.975; 8 0.975,-1.975; 13 0.975,1.975; 14 0.325,1.975; 15 -0.325,1.975; 16 -0.975,1.975 | smd 2.7 x 2.7: PAD 0,0
SOT23' = smd 1 x 1.4: 1 -0.95,-1.1; 2 0.95,-1.1; 3 0,1.1
CRYSTAL_2.5X2 = smd 0.9 x 0.8: 1 -0.825,-0.625; 2 0.825,-0.625; 3 0.825,0.625; 4 -0.825,0.625

### Placement (x,y rotation side)
C6  7.4,68.4 180 bottom
C8  26.3,7.6 0 bottom
C9  3.1,31.2 270 bottom
C11  12.7,25.1 270 bottom
C12  17.9,16.4 180 bottom
C13  22.7,5.3 270 bottom
C14  27.1,5.3 90 bottom
C15  27.7,16.1 0 bottom
C16  18,29.1 180 bottom
C17  13.4,21.1 90 bottom
C18  21.2,6.5 180 bottom
C19  8.7,29.5 0 bottom
C20  5.4,32.2 270 bottom
CARD  0,0 0 top
CF1  7,78.96 270 top
CF2  7,17 270 top
CM1  71.25,91.56 0 top
D1  18.1,6.3 90 top
D5  4.6,24.9 180 top
D6  8.1,24.9 180 top
D7  4.5,71.8 0 top
H1  93,6 0 top
H2  93,89 0 top
H4  6,6 0 top
J2  71.25,82.6 90 top
J3  87.25,50.2 90 top
J4  49.5,12.45 0 top
J5  11.75,50.2 270 top
J6  49.5,87.95 180 top
J7  28.35,88.77 0 top
J8  11.6,6.88 0 top
L1  16.6,20.6 0 bottom
Q1  12.3,29.3 90 bottom
Q2  14.3,38.2 90 bottom
Q7  12.3,42 180 bottom
Q8  6.2,59.5 90 bottom
R7  9.1,16.4 0 bottom
R8  27.82,9.6 90 bottom
R9  18.1,5.58 90 bottom
R10  9.1,15.1 0 bottom
R11  9.1,17.6 0 bottom
R39  5.5,27.8 90 bottom
R40  11.8,20.7 270 bottom
R41  5.1,70 270 bottom
R42  12.6,68.4 270 bottom
R43  13.6,70.3 270 bottom
R44  13.6,68.4 90 bottom
R45  12.6,70.3 90 bottom
R46  12.6,64.5 270 bottom
R47  13.6,66.5 270 bottom
R48  13.6,64.5 90 bottom
R49  12.6,66.5 90 bottom
R50  12.6,60.7 270 bottom
R51  13.6,62.6 270 bottom
R52  13.6,60.7 90 bottom
R53  12.6,62.6 90 bottom
R54  9,69.9 270 bottom
R55  10,69.9 270 bottom
R56  5.1,67.6 90 bottom
R57  14.3,40.6 180 bottom
R58  10.1,42.7 90 bottom
R59  14.4,33.8 270 bottom
R60  8.6,60.9 180 bottom
R61  9.6,37.7 270 bottom
R62  6.6,40.6 270 bottom
R63  4.1,40.5 0 bottom
R64  5.6,40.6 270 bottom
R65  12.3,31.7 180 bottom
R66  3.1,33.1 270 bottom
R67  4.1,32.2 270 bottom
R68  6.8,57.3 0 bottom
R69  10.5,26 180 bottom
R70  8.5,26 180 bottom
R71  3.6,69 270 bottom
TP1  87,42 0 top
TP2  41,13 0 top
TP3  14.2,58.1 0 top
TP4  58,88 0 top
TP7  29.3,10.1 270 bottom
TP24  8.7,39.2 90 bottom
TP25  4.1,42 90 bottom
TP26  8.7,40.9 90 bottom
TP27  10.5,61.3 180 bottom
TP28  9.1,59.4 90 bottom
TP29  9.1,57.7 90 bottom
TP30  7,28.3 90 bottom
TP31  19.5,23.5 180 bottom
TP32  9.5,27.1 180 top
TP33  20,19.7 180 bottom
TP34  7.5,69.9 90 bottom
TP35  5.4,62.1 90 bottom
TP36  3.6,62.1 90 bottom
TP37  3.6,63.8 90 bottom
TP38  3.6,65.5 90 bottom
TP39  3.6,67.2 90 bottom
TP40  14.4,72.3 90 bottom
TP41  12.6,72.3 90 bottom
U3  27.7,18.76 0 bottom
U4  22.1,12.1 90 bottom
U6  8.2,65.2 0 bottom
U8  6.1,36.7 90 bottom
U9  16.6,25.9 180 bottom
U10  MCP1703A  [SOT23']  8.4,32.2 90 bottom
X2  24.9,5.3 0 bottom

### Tracks (layer width: path | path; a pad name or v marks a point on that pad's centre or on a via)
3.3V  (via drill 0.25, 0.35)
  Top 0.3: v15.2,4.9 14.19,4.9 J8.1
  Top 0.7: v7.6,13.82 CF2.2 CF2.1
  Bottom 0.254: U3.3 27.38,16.73 27.2,16.56 C15.2
  Bottom 0.3: R7.2 R11.2 | C18.2 21.7,4.2 21.1,3.6 16.5,3.6 v15.2,4.9 | TP33.1 20.91,20.61 20.91,25.49 20.18,26.23 U9.10
  Bottom 0.5: 23.4,10.2 24.9,8.7 U4.1 24.9,7.6 C8.2 | 23.4,10.2 21.7,10.2 | 21.7,10.2 U4.5 C18.2 | 21.7,10.2 20.8,10.2 20.2,10.8 20.2,14.6 19.3,15.5 U4.17 | 23.4,10.2 23.4,13.4 26.1,16.1 C15.2 | v6.6,13.82 6.58,13.85 7.7,13.85 8.6,14.75 R10.2 R11.2 8.6,18.4 10.4,20.2 R40.2 C17.1
  Bottom 0.7: v7.6,13.82 v6.6,13.82
  pour Bottom (no thermals): 21,20.7 12.7,20.7 12.7,18.4 18.1,18.4 18.1,16 19.5,16 19.5,18.4 21,18.4
!FAULT
  Bottom 0.2: U6.7 7.88,62.48 7.34,61.94 Q8.3 7.3,59.46 R68.1 7.9,57.3 8.3,57.7 TP29.1
!SHUTDOWN  (via drill 0.25, 0.35)
  Top 0.23: CF1.10 10.86,80.86 10.95,80.95
  Top 0.3: J6.1 J6.2 46.33,81.62 v46.3,81.6 | v82.9,53.38 J3.2 J3.1 | J4.1 J4.2 52.67,18.77 v52.7,18.8 | J5.1 J5.2 18.07,47.02 v18.1,47 | v26.3,74.4 v27.8,72.9 | 10.95,80.95 v11,80.9
  Bottom 0.3: 16.29,84.42 v26.3,74.4 | v82.9,53.38 82,53.38 80.9,52.3 80.9,37.2 62.5,18.8 v52.7,18.8 36.5,18.8 18.1,37.2 v18.1,47 18.1,63.2 v27.8,72.9 36.5,81.6 v46.3,81.6 | v11,80.9 12.77,80.9 16.29,84.42 | 16.29,84.42 J7.40 J7.39
AD0
  Bottom 0.2: U6.1 10.06,67.76 11.2,68.9 R42.1 | R42.1 R45.1 R43.2 R44.2 R42.1
AD1
  Bottom 0.2: U6.2 10.94,65.53 10.97,65.5 12.6,65.5 | 12.6,65.5 R46.1 R48.2 R47.2 R49.1 12.6,65.5
AD2
  Bottom 0.2: U6.3 10.62,64.88 10.9,64.6 10.9,62.4 11.2,62.1 R53.1 | R53.1 R51.2 R52.2 R50.1 R53.1
BOOT1
  Bottom 0.2: U4.31 R8.2 TP7.1
CAN1_H  (via drill 0.25, 0.35)
  Top 0.2: CF1.1 5.47,75.83 v5.5,75.8
  Top 0.3: J5.9 J5.10 v18.89,52.1 v18.9,52.1 | J6.9 J6.10 v51.41,83.41 v51.4,83.4 | v28,76 v30,74 | J4.9 J4.10 v47.59,19.59 v47.6,19.6 | v80.1,48.3 J3.10 J3.9 | v31.65,24.75 v28,21.1
  Bottom 0.2: U3.7 28,20.09 | v5.5,75.8 6.9,75.8 9.5,78.4 9.5,89.6 11.9,92 19.7,92 20.09,91.61 J7.33
  Bottom 0.3: v51.4,83.4 48.8,80.8 36.8,80.8 v30,74 18.9,62.9 v18.9,52.1 18.9,37.5 v31.65,24.75 36.8,19.6 v47.6,19.6 62.2,19.6 80.1,37.5 v80.1,48.3 | v28,21.1 28,20.09 | v28,76 20.09,83.91 J7.34 J7.33
CAN1_L  (via drill 0.25, 0.35)
  Top 0.2: CF1.2 8.62,75.83 v8.6,75.8
  Top 0.3: J5.11 J5.12 19.62,53.38 v19.7,53.3 | J6.11 J6.12 52.67,83.47 v52.6,83.4 | v27.1,75.2 v29.7,72.6 | J4.11 J4.12 46.3,15.74 v46.3,20.4 | v79.3,47 79.33,47.02 J3.12 J3.11 | v31.3,26.2 v27.4,22.3
  Bottom 0.2: 27.4,22.04 27.38,22.02 | v8.6,75.8 10,77.2 10,89.3 12.2,91.5 18.5,91.5 18.82,91.17 J7.35
  Bottom 0.3: v52.6,83.4 49.2,80 37.1,80 v29.7,72.6 19.7,62.6 v19.7,53.3 19.7,37.8 v31.3,26.2 37.1,20.4 v46.3,20.4 61.9,20.4 79.3,37.8 v79.3,47 | 27.38,22.02 U3.6 | v27.1,75.2 18.82,83.47 J7.36 J7.35 | v27.4,22.3 27.38,22.3 27.38,22.02
CAN2_H  (via drill 0.25)
  Top 0.2: v5.4,79.6 4.29,79.6 CF1.7
  Bottom 0.2: 4.7,90.2 4.7,80.3 v5.4,79.6
  Bottom 0.23: 4.7,90.2 8.2,93.7 25,93.7 27.71,90.98 27.71,89.5 J7.21 J7.22
CAN2_L  (via drill 0.25)
  Top 0.2: CF1.8 8.61,79.59 v8.56,79.64
  Bottom 0.2: 26.45,91.25 24.5,93.2 8.3,93.2 | 5.3,90.2 5.3,82.9 v8.56,79.64
  Bottom 0.23: 8.3,93.2 5.3,90.2 | 26.45,91.25 J7.23 J7.24
CAN_RX  (via drill 0.25)
  Top 0.2: v22.5,17.5 v24,17.5
  Bottom 0.2: U4.21 v22.5,17.5 | v24,17.5 24.04,17.46 U3.4
CAN_SHDN
  Bottom 0.2: U4.20 21.7,17.5 23.1,18.9 26.4,18.9 26.7,19.2 26.7,20.04 U3.5
CAN_SILENT
  Bottom 0.2: U3.8 28.68,22.52 28.3,22.9 27.1,22.9 26.7,22.5 26.7,21.2 24.9,19.4 23.1,19.4 20.9,17.2 U4.19
CAN_TX
  Bottom 0.2: U3.1 28.68,18.23 28.5,18.4 23.9,18.4 23.3,17.8 U4.22
CB-RESET  (via drill 0.25)
  Top 0.2: v3.96,38.6 3.96,39.96 5,41 v5,43.1
  Bottom 0.2: U6.5 9.18,60.98 R60.2 TP28.1 9.9,58.59 9.9,57.1 9.3,56.5 6.4,56.5 4.9,55 4.9,43.2 v5,43.1 | U8.9 5.08,38.6 v3.96,38.6
CB_CTRL  (via drill 0.25)
  Top 0.2: v3.2,35.7 4.1,35.7 | 4.1,35.7 6.5,35.7 v11,31.2 | 4.1,35.7 4.05,35.75 4.05,37.05 3,38.1 3,42.8 v3.3,43.1
  Bottom 0.2: R65.1 11.3,31.7 11,31.4 v11,31.2 Q1.3 | U8.6 3.48,36.38 3.2,36.1 v3.2,35.7 3.2,34.6 3.6,34.2 4.42,34.2 4.72,33.9 5.12,33.9 | U8.4 5.12,33.9 | U8.3 5.78,33.9 5.12,33.9 | Q8.1 5.1,58.51 5.1,57.3 3.3,55.5 v3.3,43.1
CRYSTALIN1
  Bottom 0.2: 25.7,4.7 25.2,4.7 24.9,5 24.9,6.5 24.1,7.1 U4.2
  Bottom 0.25: C14.1 26.98,4.67 X2.1 25.7,4.7
CRYSTALOUT1
  Bottom 0.2: U4.3 23.3,6.7 X2.3
  Bottom 0.25: C13.1 23.95,5.8 X2.3
GND  (via drill 0.25)
  Bottom 0.3: U3.2 28.02,16.64 28.2,16.46 C15.1 | J7.38 J7.37 | 15.62,24.93 U9.16 15.62,23.18 | 15.62,24.93 U9.1 13.93,24.93 | 15.62,24.93 U9.PAD | U9.6 16.27,26.23 U9.PAD | U9.7 16.93,26.23 U9.PAD | U9.9 17.57,26.88 U9.PAD | U9.11 16.93,25.57 U9.PAD | U9.12 17.57,24.93 U9.PAD
  other vias: 86.5,90.5 86.5,88 68,88 68,90.5 22.1,12.1 29.1,16.08 19.5,10.4 17.4,17.3 16.8,15.6 20.7,5.6 22.7,3.9 24.1,3.7 26.8,6.7 26.8,8.5 25.1,9.6 19.1,14.6 22.12,14.9 27.1,3.9 16.3,83.5 17.5,85.8 15,85.9 19.7,24.9 19.7,25.5 18.7,27.8 19.7,26.9 16.6,25.9 15.8,25.1 17.4,25.1 17.4,26.7 15.8,26.7 14.1,24.2 14.9,23.3 13.8,23.3 13,23.1 8.5,62.3 8.2,65.2 6,68 6,68.7 7,29.48 5.4,30.48 2.2,33.6 6.1,36.7 3.1,37 5.1,59.5 7.5,41.1 5.6,41.9 12.3,42 14.5,43.1 8.3,61.8 11.6,39.7 10,41.2 18.2,23.1 15.7,33.8 15.4,74.9 10.7,35.8 10.7,33.9 8.3,32.2 6.4,30.2 14.6,21.3 20.3,21.3 14.5,67.9 14.5,64 14.5,60.2
  pour Top (isolate 0.2, rank 6): 0,0 99,0 99,95.3 0,95.3
  pour Bottom (isolate 0.2, rank 6): 0,0 99,0 99,95.3 0,95.3
MAX4211-3V3
  Bottom 0.3: U8.1 7.08,33.38 U10.2
  Bottom 0.5: C20.1 6.2,33 6.4,33.2 7.25,33.2 U10.2
N$1  (via drill 0.35)
  Top 0.3: J4.8 J4.7 v48.87,13.35
  Bottom 0.3: v48.87,13.35 48.87,8.46 46.9,6.5 42.5,6.5 41,8 TP2.TP
N$2  (via drill 0.35)
  Top 0.3: J3.8 J3.7 86.44,49.56 v86.5,49.5
  Bottom 0.3: v86.5,49.5 90.5,49.5 93.2,46.8 93.2,44 91.2,42 TP1.TP
N$4  (via drill 0.25)
  Top 0.3: J5.8 J5.7 v12.56,50.84
  Bottom 0.2: TP3.TP 14.2,52.47 v12.56,50.84
N$5  (via drill 0.35)
  Top 0.3: J6.8 J6.7 v50.13,87.05
  Bottom 0.3: v50.13,87.05 50.13,90.83 52.5,93.2 56.4,93.2 58,91.6 TP4.TP
N$6  (via drill 0.25)
  Top 0.3: v5.5,26.3 5.5,24.92 D5.A
  Bottom 0.3: R39.1 v5.5,26.3
N$7  (via drill 0.25)
  Top 0.2: v18.1,4.3 D1.A
  Bottom 0.2: R9.1 v18.1,4.3
N$8  (via drill 0.25)
  Top 0.3: v10.3,24.9 D6.A
  Bottom 0.3: R40.1 10.3,22.7 v10.3,24.9
N$9
  Bottom 0.2: U6.13 7.18,67.1 R56.1
N$10
  Bottom 0.2: Q7.3 12.94,40.86 13.2,40.6 | 13.2,40.6 R57.1 | Q2.3 13,40.4 13.2,40.6
N$11
  Bottom 0.152: R59.1 14.4,34.2 14.2,34 11.7,34 9.97,35.73 U8.16
  pour Bottom (no thermals): 16,38.5 12.4,38.5 12.4,34.5 16,34.5
N$12
  Bottom 0.2: R61.1 9.6,39.5 9,40.1 8.7,40.1 | 8.7,40.1 R62.2 6.6,39.5 6.42,39.33 U8.11 | TP26.1 8.7,40.1
N$13
  Bottom 0.2: U8.10 5.78,39.42 5.6,39.6 R64.2 5.3,40.1 4.9,40.5 R63.1 4.6,41.5 TP25.1
N$14
  Bottom 0.2: U8.14 8.93,37.02 9.1,37.2 R61.2
N$15
  Bottom 0.2: J7.13 J7.14
N$16  (via drill 0.25)
  Top 0.2: v7.6,39.4 6.2,39.4 6.1,39.5 v4.7,39.5
  Bottom 0.2: R63.2 3.6,39.5 | U8.12 7.08,39.27 7.2,39.4 v7.6,39.4 | U8.8 3.42,37.67 3.2,37.9 3.2,39.3 3.4,39.5 3.6,39.5 | 3.6,39.5 v4.7,39.5
N$17
  Bottom 0.2: U8.13 7.96,38.46 TP24.1
N$18  (via drill 0.25)
  Top 0.2: v4.2,34.9 4.2,34.2 4.1,34.1 v4.1,33.5
  Bottom 0.2: U8.5 4.24,34.94 v4.2,34.9 | v4.1,33.5 R67.1
N$19
  Bottom 0.2: R67.2 C9.1 R66.2
N$20  (via drill 0.25)
  Top 0.152: v11.3,36.4 11.3,34.9 11.4,34.8 v11.4,33.3
  Bottom 0.152: R59.2 14.4,32.5 14.4,33.4 14.2,33.6 11.7,33.6 v11.4,33.3 | v11.3,36.4 11.28,36.38 U8.15
  Bottom 0.5: C19.1 U10.3 9.5,32.5 14.4,32.5
  pour Bottom (no thermals): 12.6,29.9 12.6,33.1 16,33.1 16,29.9
N$21
  Bottom 0.2: U6.8 6.34,63.34 5.4,62.4 TP35.1
N$22
  Bottom 0.2: TP36.1 5.2,63.7 5.2,64 5.42,64.22 U6.9
N$23
  Bottom 0.2: U6.10 4.67,64.88 TP37.1
N$24
  Bottom 0.2: U6.11 3.62,65.53 TP38.1
N$25
  Bottom 0.2: U6.12 4.62,66.17 TP39.1 R71.2
N$26  (via drill 0.25)
  Top 0.2: v3.6,70.7 3.62,70.72 D7.A
  Bottom 0.2: R71.1 v3.6,70.7
NRESET  (via drill 0.25)
  Top 0.2: v22.8,9.1 16.9,9.1 15,7.2 9.2,7.2 9.06,7.34 J8.10
  Bottom 0.3: U4.4 22.5,8.8 v22.8,9.1
ON/!OFF
  Bottom 0.2: U6.4 10.06,62.24 10.5,61.8 TP27.1 10.5,55.9 10.1,55.5 R58.2 10.16,43.14 Q7.1
OPD_PWR  (via drill 0.25)
  Top 0.2: J7.20 J7.19
  Top 0.5: J7.19 28.98,91.02 28,92 15.6,92 13.1,89.5 13.1,84.2 11.45,82.55 | CF1.12 11.04,82.14 11.45,82.55 | 11.45,82.55 12.6,81.4 12.6,73.9 9.6,70.9 6.6,70.9 v6.2,70.5
  Bottom 0.5: v6.2,70.5 R41.1
OPD_SCL  (via drill 0.25)
  Top 0.2: J7.18 J7.17 30.25,90.94 28.6,92.6 15.4,92.6 12.5,89.7 12.5,84.31 11.1,82.91 7.91,82.91 5.87,80.86 CF1.9 3.77,80.86 3.3,80.4 3.3,75.4 3.8,74.9 v4.8,74.9
  Bottom 0.2: v4.8,74.9 4.82,74.88 4.82,73.94 6.56,72.2 8.1,72.2 9,71.3 R54.1
OPD_SDA  (via drill 0.25)
  Top 0.2: J7.16 J7.15 31.52,90.97 29.5,93 15.3,93 12.1,89.8 12.1,84.41 10.95,83.26 7.76,83.26 6.6,82.1 4.29,82.1 CF1.11 3.54,82.14 2.95,81.55 2.95,75.15 3.76,74.34 5.34,74.34 v5.9,74.9
  Bottom 0.2: v5.9,74.9 7.5,74.9 10,72.4 10,71.5
  Bottom 0.25: 10,71.5 R55.1
PA0
  Bottom 0.2: U4.6 20.9,8.7 20.4,9.2 19.3,9.2 18.1,8 R9.2
PB4/I2C-!RESET  (via drill 0.25)
  Top 0.2: v24.9,13.8 16.5,13.8 11.4,18.9 CF2.10
  Top 0.3: CF2.10 CF2.9
  Bottom 0.2: U4.27 25.4,13.3 v24.9,13.8
PB5/I2C-!INT  (via drill 0.25)
  Top 0.2: v24.9,12.7 24.15,13.45 16.35,13.45 12.2,17.6 v10.91,17.6
  Top 0.3: CF2.7 CF2.8 9.79,17.6 v10.91,17.6
  Bottom 0.2: U4.28 25.1,12.5 v24.9,12.7
  Bottom 0.3: R11.1 v10.91,17.6
PB6/SCL  (via drill 0.25)
  Top 0.2: v25,11.7 23.61,13.1 16.21,13.1 12.94,16.36 v10.91,16.36
  Top 0.3: CF2.5 CF2.6 v10.91,16.36
  Bottom 0.2: U4.29 v25,11.7
  Bottom 0.3: R7.1 9.63,16.36 v10.91,16.36
PB7/SDA  (via drill 0.25)
  Top 0.2: v25,10.6 25,10.61 22.87,12.74 16.06,12.74 13.71,15.1 v10.91,15.1
  Top 0.3: CF2.3 CF2.4 v10.91,15.1
  Bottom 0.2: U4.30 25.35,10.9 25.05,10.6 v25,10.6
  Bottom 0.3: v10.91,15.1 v10.91,15.11 R10.1
PEN-SCL-FILT  (via drill 0.25)
  Top 0.2: v9,68.6 9,69.3 11.1,71.4 13.5,71.4 TP40.1
  Bottom 0.2: U6.15 8.53,68.12 v9,68.6 R54.2 | 15.1,67 R47.1 | 15.1,67 15.1,63.6 14.6,63.1 R51.1 | TP40.1 14.4,70.8 | 14.4,70.8 15.1,70.1 15.1,67 | R43.1 14.4,70.8
PEN-SDA-FILT  (via drill 0.25)
  Top 0.2: v11.5,70.8 12.1,70.2 12.1,67.6 v11.5,67 12.1,66.4 12.1,63.77 v11.5,63.1
  Bottom 0.2: U6.16 9.18,67.78 10,68.6 R55.2 10.6,69.4 11.5,70.3 v11.5,70.8 R45.2 TP41.1 | v11.5,67 R49.2 | v11.5,63.1 R53.2
RF1
  Top 0.3: J2.FEED CM1.RF
SPARE1
  Bottom 0.2: J7.11 J7.12
SPARE2
  Bottom 0.2: J7.9 J7.10
SPARE3
  Bottom 0.2: J7.7 J7.8
SPARE4
  Bottom 0.2: J7.5 J7.6
SPARE5
  Bottom 0.2: J7.3 J7.4
SPARE6
  Bottom 0.2: J7.1 J7.2
SWCLK  (via drill 0.25)
  Top 0.2: v22.2,11 21.6,11.6 13.9,11.6 12.87,10.57 J8.4
  Bottom 0.2: U4.24 24.9,15.61 22.86,13.57 22.86,11.66 v22.2,11
SWDIO  (via drill 0.25)
  Top 0.2: v21.1,11 14.7,11 14.14,10.44 J8.2
  Bottom 0.2: U4.23 24.1,15.51 21.1,12.51 v21.1,11
TPS62111-PG1
  Bottom 0.2: U9.13 18.38,23.93 18.8,23.5 TP31.1
TPS62111-SYNC1  (via drill 0.25)
  Top 0.2: v14.9,27.9 10.3,27.9 TP32.1
  Bottom 0.2: U9.5 14.93,27.88 v14.9,27.9 | R70.2 9.5,26 | 9.5,26 R69.1 | 9.5,26 TP32.1
TPS62111_SW1
  pour Bottom (no thermals): 16.3,24.2 16.9,24.2 16.9,22 16.3,22
VBUS  (via drill 0.35)
  Top 0.7: J3.5 J3.6 v82.9,50.84 v81.9,50.84 | J4.5 J4.6 v50.13,17.8 | J6.5 J6.6 v48.87,82.6 | J5.5 J5.6 v16.1,49.56 v17.1,49.56 | v11.8,78.36 v10.9,78.36 CF1.6 CF1.5
  Bottom 0.2: 17.1,39.15 17.1,39.1
  Bottom 0.3: J7.28 J7.27 J7.25 J7.26 24.6,88.13 J7.28
  Bottom 0.7: 32.55,79.05 36.1,82.6 v48.87,82.6 v48.87,83.4 | 32.55,79.05 25,71.5 | v17.1,49.56 17.1,63.6 25,71.5 | v17.1,49.56 17.1,39.1 17.1,36.8 36.1,17.8 v50.13,17.8 | v50.13,17.8 62.9,17.8 81.9,36.8 v81.9,50.84 | v17.1,49.56 v16.1,49.56 | v50.13,17.8 v50.13,16.8 | 25,71.5 18.18,78.36 v11.8,78.36 v10.9,78.36 | 24.6,88.13 24.6,87 32.55,79.05
  pour Bottom (isolate 0.2, no thermals): 17.33,38.9 14.54,38.9 14.54,41.1 17.33,41.1
VBUSP  (via drill 0.25)
  Bottom 0.3: Q1.1 9.75,28.35 v9.7,28.3 TP30.1 R39.2 4.3,28.3 3.1,29.5 C9.2
  pour Bottom (no thermals): 10.6,25.5 10.6,29.5 18,29.5 18,27.6 14.9,27.6 14.9,25.5
VPD  (via drill 0.25)
  Top 0.2: TP34.1 7.5,69.1 8.7,67.9 v11.5,67.9 10.9,67.3 10.9,64.6 v11.5,64 10.9,63.4 10.9,62.7 11.5,62.1 v11.5,60.2 9.44,60.2 9.43,60.2 7.91,60.2 v6.3,58.6
  Bottom 0.2: R56.2 R41.2 | v11.5,67.9 R42.2 | v11.5,64 R46.2 | R50.2 v11.5,60.2 | R68.2 v6.3,58.6
  Bottom 0.3: U6.14 7.88,68.58 C6.2
  Bottom 0.4: R41.2 6.2,69.5 6.6,69.9 TP34.1 7.88,69.53 7.88,68.58

### Text on the board
tPlace: VBUSP | 3.3V | OreSat +Z End Card v1.0 | 2018/12/21